# Altium schematic sheet Geiger_Pwr_LM3478.SchDoc
size A4
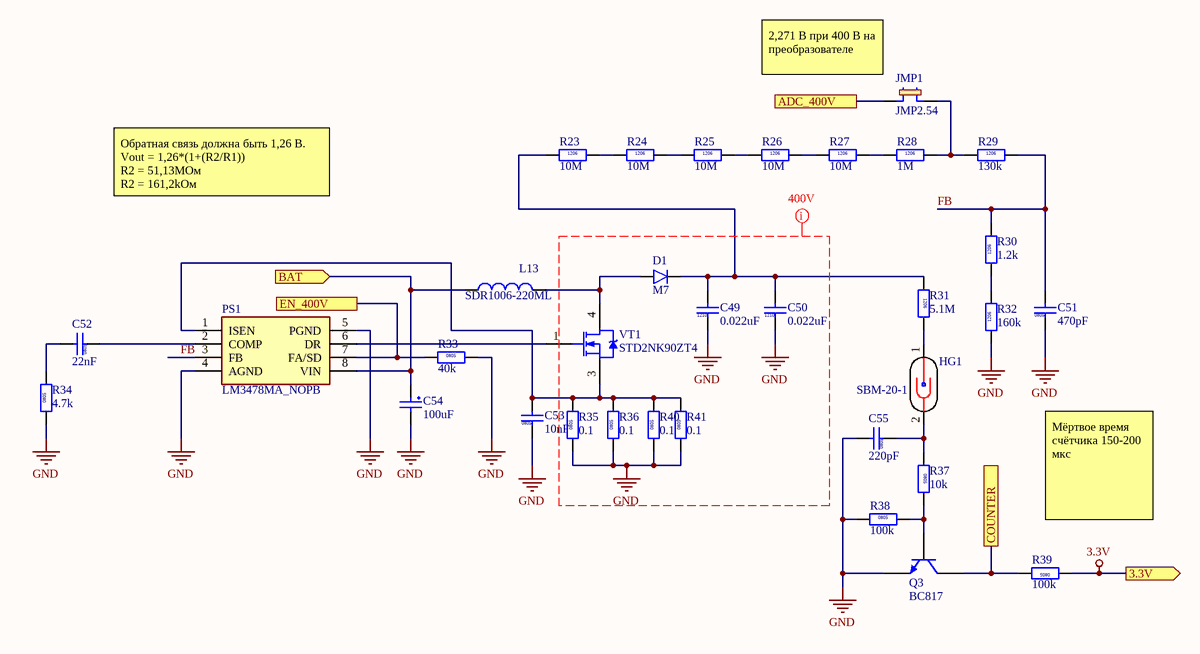
[diagram p0: Geiger_Pwr_LM3478.SchDoc]

## Parts
C49  value 0.022uF  [CAPC3225-1210L]  (hidden comment: CAPC_1210)
C50  value 0.022uF  [CAPC3225-1210L]  (hidden comment: CAPC_1210)
C51  value 470pF  [CAPC2012-0805M]  (hidden comment: CAPC_0805)
C52  value 22nF  [CAPC2012-0805M]  (hidden comment: CAPC_0805)
C53  value 10nF  [CAPC2012-0805M]  (hidden comment: CAPC_0805)
C54  value 100uF  [ECAP511]  (hidden comment: ECAP-511)
C55  value 220pF  [CAPC2012-0805M]  (hidden comment: CAPC_0805)
D1  M7  [DIOM5026X262N]
HG1  SBM-20-1  [SBM-20-1]
JMP1  JMP2.54  [JMP2.54]
L13  SDR1006-220ML  [SDR1006]
PS1  LM3478MA_NOPB  [SOIC127P600X175-8N]
Q3  BC817  [SOT23-3M]
R23  value 10M  [RESC3216-1206M]  (hidden comment: RESC_1206_R)
R24  value 10M  [RESC3216-1206M]  (hidden comment: RESC_1206_R)
R25  value 10M  [RESC3216-1206M]  (hidden comment: RESC_1206_R)
R26  value 10M  [RESC3216-1206M]  (hidden comment: RESC_1206_R)
R27  value 10M  [RESC3216-1206M]  (hidden comment: RESC_1206_R)
R28  value 1M  [RESC3216-1206M]  (hidden comment: RESC_1206_R)
R29  value 130k  [RESC3216-1206M]  (hidden comment: RESC_1206_R)
R30  value 1.2k  [RESC3216-1206M]  (hidden comment: RESC_1206_R)
R31  value 5.1M  [RESC3216-1206M]  (hidden comment: RESC_1206_R)
R32  value 160k  [RESC3216-1206M]  (hidden comment: RESC_1206_R)
R33  value 40k  [RESC2012-0805M]  (hidden comment: RESC_0805_R)
R34  value 4.7k  [RESC2012-0805M]  (hidden comment: RESC_0805_R)
R35  value 0.1  [RESC2012-0805M]  (hidden comment: RESC_0805_R)
R36  value 0.1  [RESC2012-0805M]  (hidden comment: RESC_0805_R)
R37  value 10k  [RESC2012-0805M]  (hidden comment: RESC_0805_R)
R38  value 100k  [RESC2012-0805M]  (hidden comment: RESC_0805_R)
R39  value 100k  [RESC2012-0805M]  (hidden comment: RESC_0805_R)
R40  value 0.1  [RESC2012-0805M]  (hidden comment: RESC_0805_R)
R41  value 0.1  [RESC2012-0805M]  (hidden comment: RESC_0805_R)
VT1  STD2NK90ZT4  [TO228P972X240-3N]

## Ports
3.3V (out), ADC_400V, BAT (in), COUNTER, EN_400V

## Nets
3.3V: R39.1 ; port 3.3V
GND: C49.1 C50.1 C51.1 C53.1 C54.2 C55.2 PS1.4(AGND) PS1.5(PGND) Q3.2(E) R32.1 R33.2 R34.1 R35.1 R36.1 R38.1 R40.1 R41.1
ADC_400V: JMP1.1 ; port ADC_400V
BAT: C54.1 L13.1 PS1.8(VIN) ; port BAT
COUNTER: Q3.3(C) R39.2 ; port COUNTER
EN_400V: PS1.7(FA/SD) R33.1 ; port EN_400V
FB: C51.2 PS1.3(FB) R29.2 R30.2
NetC49_2: C49.2 C50.2 D1.1(K) R23.1 R31.1
NetC52_1: C52.1 PS1.2(COMP)
NetC52_2: C52.2 R34.2
NetC53_2: C53.2 PS1.1(ISEN) R35.2 R36.2 R40.2 R41.2 VT1.3(S)
NetC55_1: C55.1 HG1.2(K) R37.1
NetD1_2: D1.2(A) L13.2 VT1.4(D)
NetHG1_1: HG1.1(A) R31.2
NetJMP1_2: JMP1.2 R28.2 R29.1
NetPS1_6: PS1.6(DR) VT1.1(G)
NetQ3_1: Q3.1(B) R37.2 R38.2
NetR23_2: R23.2 R24.1
NetR24_2: R24.2 R25.1
NetR25_2: R25.2 R26.1
NetR26_2: R26.2 R27.1
NetR27_2: R27.2 R28.1
NetR30_1: R30.1 R32.2

## Layout directives
net class 400V: GND

## Notes on the sheet
- (near JMP1) 2,271 В при 400 В на преобразователе
- Обратная связь должна быть 1,26 В.
  Vout = 1,26*(1+(R2/R1))
  R2 = 51,13МОм
  R2 = 161,2kОм
- Мёртвое время счётчика 150-200 мкс
- Labels drawn without touching a wire or pin: GND
- (in symbol CAPC_0805) 0805
- (in symbol CAPC_1210) 1210
- (in symbol RESC_0805_R) 0805
- (in symbol RESC_1206_R) 1206

## Library data of the parts
C49 C50 = CAPC_1210: Capacitor 1210
C51-C53 C55 = CAPC_0805: Capacitor 0805
C54 = ECAP-511: Capacitor electrolytic 2.5 mm pitch, 5*11 body
D1 = M7: Diode; Manufacturer_Name: MULTICOMP; Manufacturer_Part_Number: SS34A; Datasheet Link: https://componentsearchengine.com/Datasheets/2/SS34A.pdf; Height: 2.62mm
JMP1 = JMP2.54: 2.54mm single jumper
L13 = SDR1006-220ML: Connector; Manufacturer_Name: Bourns; Allied_Number: 70154258; Datasheet Link: https://www.mouser.com/datasheet/2/54/DR1006-1391503.pdf; Height: 5.8mm; Manufacturer_Part_Number: SDR1006-220ML; Mouser Part Number: 652-SDR1006-220ML; Mouser Price/Stock: https://www.mouser.com/Search/Refine.aspx?Keyword=652-SDR1006-220ML; RS Part Number: 7361349P; RS Price/Stock: http://uk.rs-online.com/web/p/products/7361349P; Allied Price/Stock: https://www.alliedelec.com/bourns-sdr1006-220ml/70154258/
PS1 = LM3478MA_NOPB: Power Supply; Manufacturer_Name: Texas Instruments; Manufacturer_Part_Number: LM3478MA/NOPB; Datasheet Link: http://www.ti.com/lit/gpn/lm3478; Height: 1.75mm; Mouser Part Number: 926-LM3478MA/NOPB; Mouser Price/Stock: https://www.mouser.com/Search/Refine.aspx?Keyword=926-LM3478MA%2FNOPB; RS Part Number: 8115560P; RS Price/Stock: http://uk.rs-online.com/web/p/products/8115560P
Q3 = BC817: BC817 NPN Transistor
R23-R32 = RESC_1206_R: Resistor 1206
R33-R41 = RESC_0805_R: Resistor 0805
VT1 = STD2NK90ZT4: Integrated Circuit; Manufacturer_Name: STMicroelectronics; Allied_Number: 70390747; Datasheet Link: http://docs-emea.rs-online.com/webdocs/0dbf/0900766b80dbfe4f.pdf; Height: 2.4mm; Manufacturer_Part_Number: STD2NK90ZT4; Mouser Part Number: 511-STD2NK90Z; Mouser Price/Stock: https://www.mouser.com/Search/Refine.aspx?Keyword=511-STD2NK90Z; RS Part Number: 6875100P; RS Price/Stock: http://uk.rs-online.com/web/p/products/6875100P; Allied Price/Stock: http://www.alliedelec.com/stmicroelectronics-std2nk90zt4/70390747/